# Altium schematic sheet SOC_DISPLAY.schdoc: =
size A3; Symbol: Sheet-Symbol_A4; Company: 嘉立创EDA; Version: V1.0; Page Size: A4; @Project Name: RK3568_LPD4X_120P_Core; @Page Count: 18; @Update Date: 2025-08-25; @Create Date: 2025-08-15; @Schematic Name: Schematic1; @Page No: 10; @Page Name: SOC_DISPLAY; Device: Sheet-Symbol_A4; Border: 1; Title Block Position: 3; Width: 1655; Height: 1170; Region Start: 1; X Region Count: 6; Y Region Count: 4; Blade Width: 10; @Board Name: Board1; @Create Time: 15:00:32; @Update Time: 13:23:47; Organization: ORGANIZATION; Address1: ADDRESS 1; Address2: ADDRESS 2; Address3: ADDRESS 3; Address4: ADDRESS 4; SheetNumber: 12; SheetTotal: 28
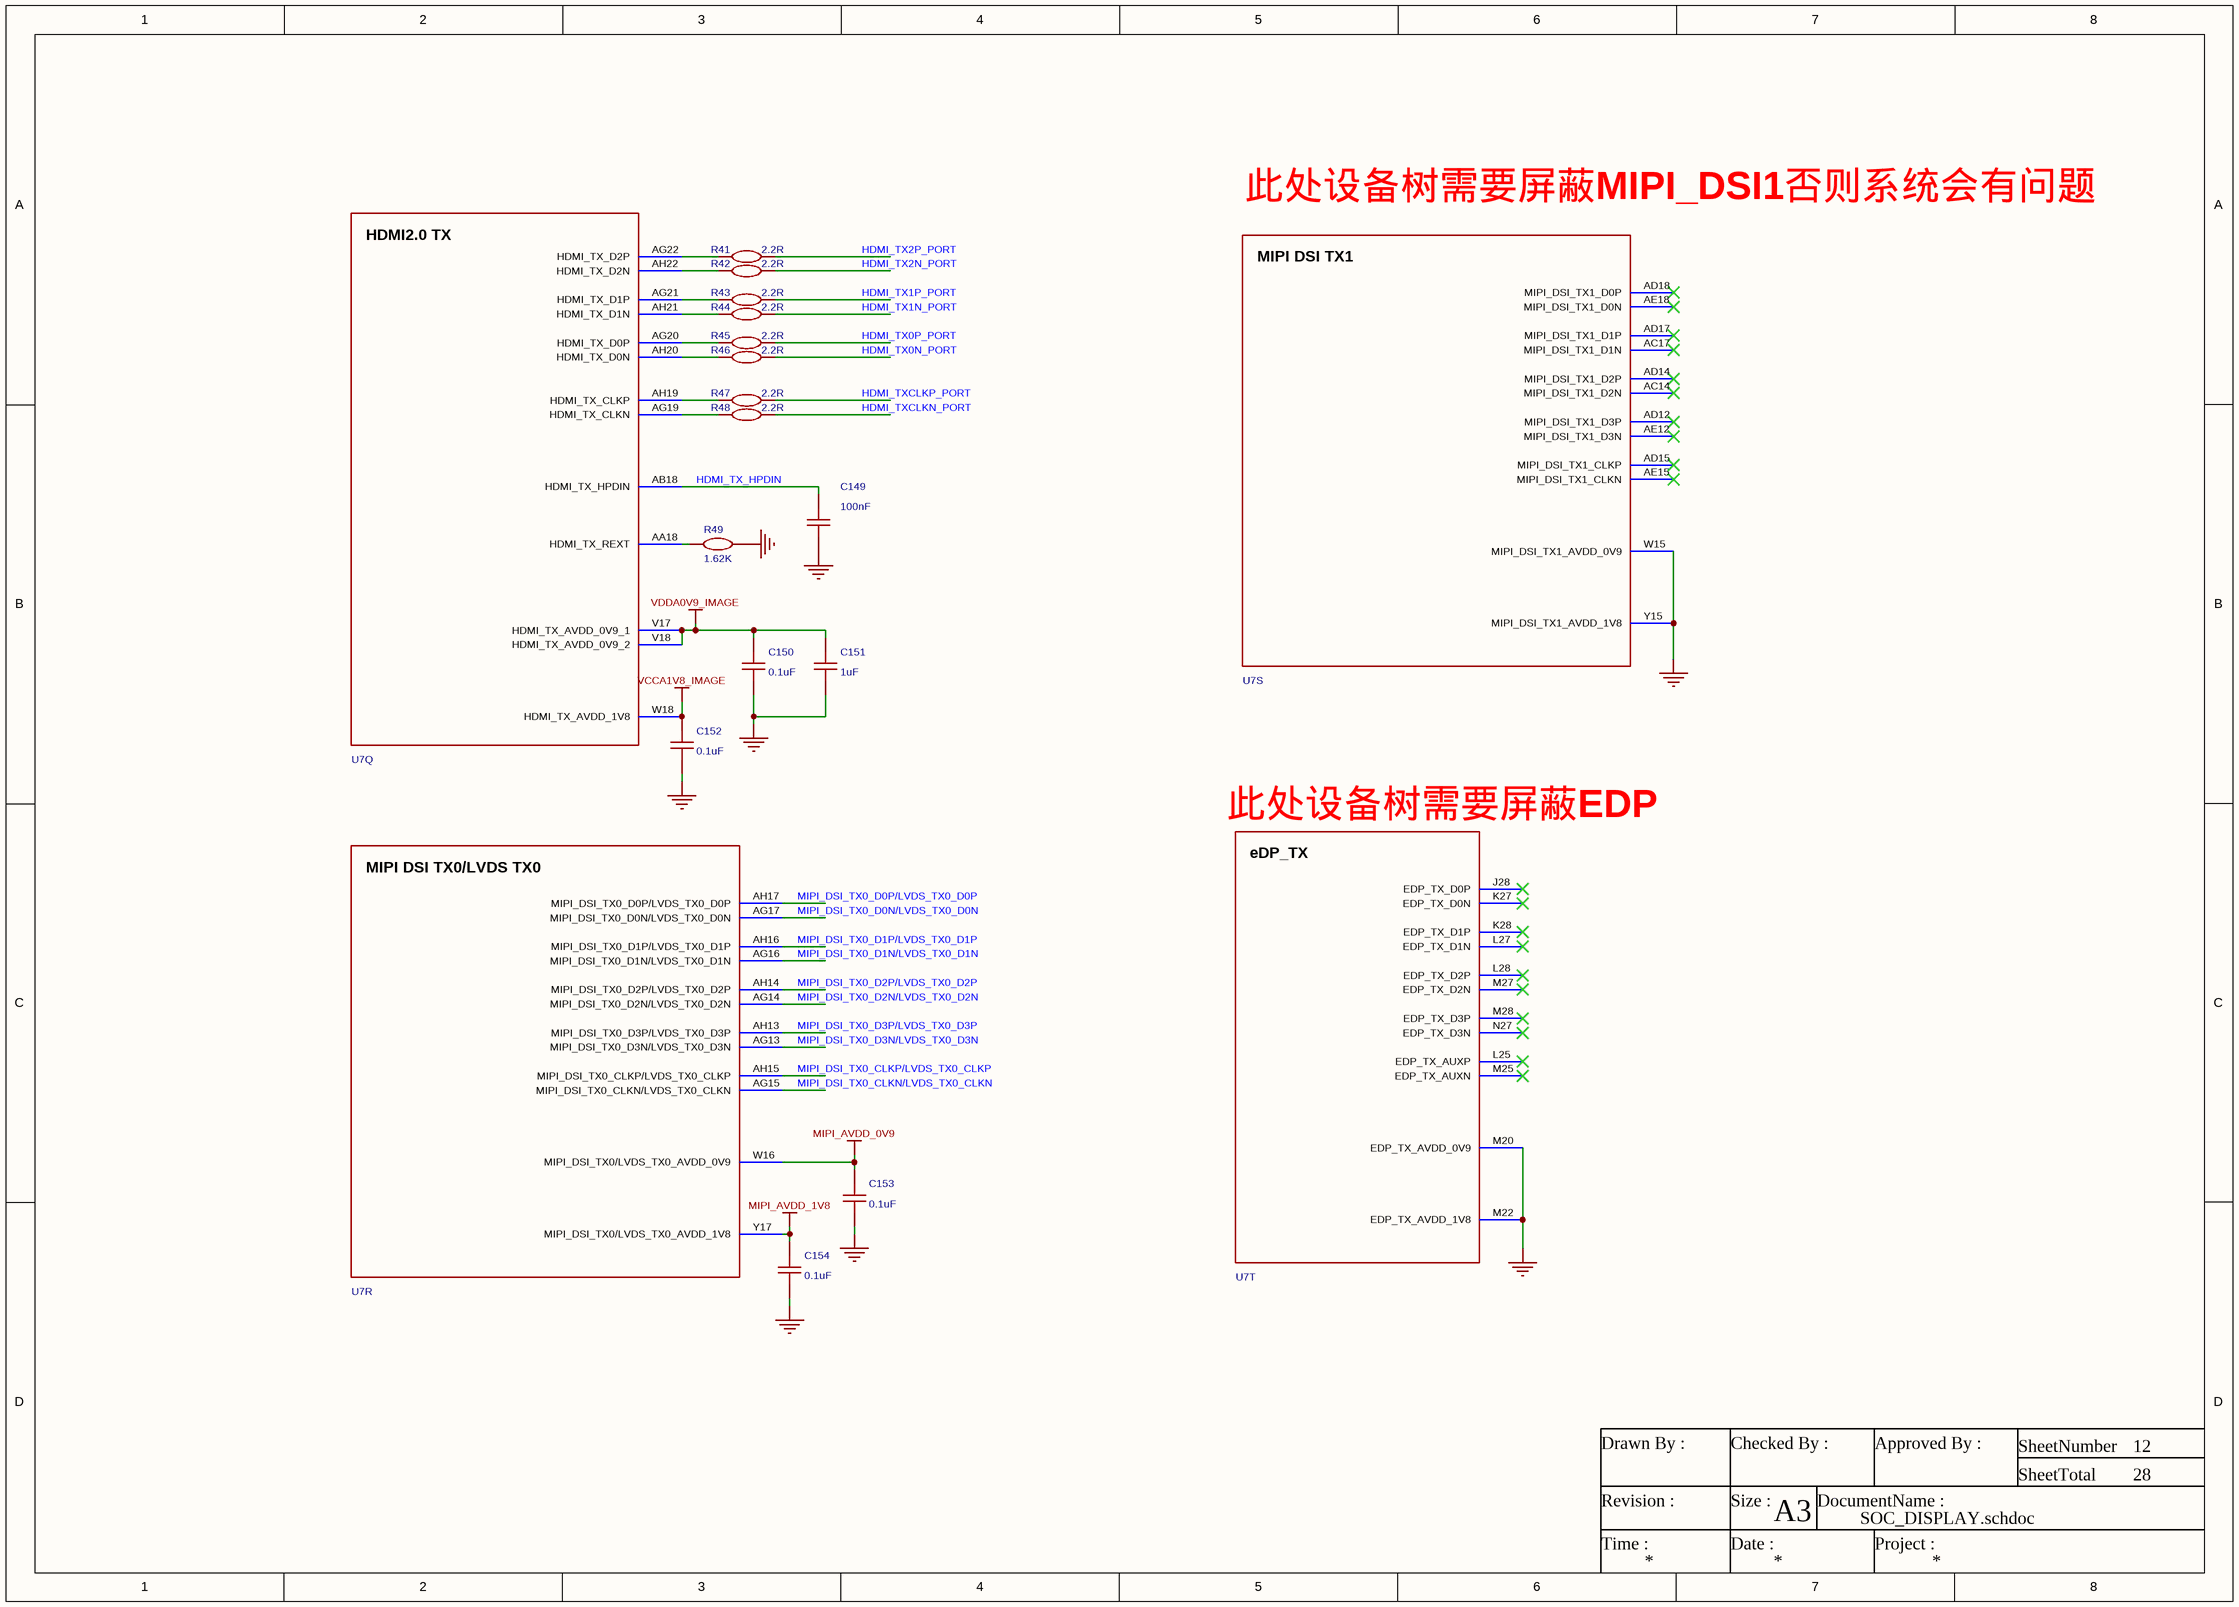
[diagram p0: SOC_DISPLAY.schdoc]

## Parts
C149  100nF  [C0201]
C150  0.1uF  [C0201]
C151  1uF  [C0201]
C152  0.1uF  [C0201]
C153  0.1uF  [C0201]
C154  0.1uF  [C0201]
R41  2.2R  [R0201]
R42  2.2R  [R0201]
R43  2.2R  [R0201]
R44  2.2R  [R0201]
R45  2.2R  [R0201]
R46  2.2R  [R0201]
R47  2.2R  [R0201]
R48  2.2R  [R0201]
R49  1.62K  [R0201]
U7  RK3568  [BGA-636_L19.0-W19.0-P0.65-BL]  (value not drawn)  (parts Q,R,S,T of 23)

## Nets
GND: C149.1 C150.1 C151.1 C152.1 C153.1 C154.1 R49.2 U7.M20(EDP_TX_AVDD_0V9) U7.M22(EDP_TX_AVDD_1V8) U7.W15(MIPI_DSI_TX1_AVDD_0V9) U7.Y15(MIPI_DSI_TX1_AVDD_1V8)
MIPI_AVDD_0V9: C153.2 U7.W16(MIPI_DSI_TX0/LVDS_TX0_AVDD_0V9)
MIPI_AVDD_1V8: C154.2 U7.Y17(MIPI_DSI_TX0/LVDS_TX0_AVDD_1V8)
VCCA1V8_IMAGE: C152.2 U7.W18(HDMI_TX_AVDD_1V8)
VDDA0V9_IMAGE: C150.2 C151.2 U7.V17(HDMI_TX_AVDD_0V9_1) U7.V18(HDMI_TX_AVDD_0V9_2)
HDMI_TX0N_PORT: R46.2
HDMI_TX0P_PORT: R45.2
HDMI_TX1N_PORT: R44.2
HDMI_TX1P_PORT: R43.2
HDMI_TX2N_PORT: R42.2
HDMI_TX2P_PORT: R41.2
HDMI_TX_HPDIN: C149.2 U7.AB18(HDMI_TX_HPDIN)
HDMI_TXCLKN_PORT: R48.2
HDMI_TXCLKP_PORT: R47.2
MIPI_DSI_TX0_CLKN/LVDS_TX0_CLKN: U7.AG15(MIPI_DSI_TX0_CLKN/LVDS_TX0_CLKN)
MIPI_DSI_TX0_CLKP/LVDS_TX0_CLKP: U7.AH15(MIPI_DSI_TX0_CLKP/LVDS_TX0_CLKP)
MIPI_DSI_TX0_D0N/LVDS_TX0_D0N: U7.AG17(MIPI_DSI_TX0_D0N/LVDS_TX0_D0N)
MIPI_DSI_TX0_D0P/LVDS_TX0_D0P: U7.AH17(MIPI_DSI_TX0_D0P/LVDS_TX0_D0P)
MIPI_DSI_TX0_D1N/LVDS_TX0_D1N: U7.AG16(MIPI_DSI_TX0_D1N/LVDS_TX0_D1N)
MIPI_DSI_TX0_D1P/LVDS_TX0_D1P: U7.AH16(MIPI_DSI_TX0_D1P/LVDS_TX0_D1P)
MIPI_DSI_TX0_D2N/LVDS_TX0_D2N: U7.AG14(MIPI_DSI_TX0_D2N/LVDS_TX0_D2N)
MIPI_DSI_TX0_D2P/LVDS_TX0_D2P: U7.AH14(MIPI_DSI_TX0_D2P/LVDS_TX0_D2P)
MIPI_DSI_TX0_D3N/LVDS_TX0_D3N: U7.AG13(MIPI_DSI_TX0_D3N/LVDS_TX0_D3N)
MIPI_DSI_TX0_D3P/LVDS_TX0_D3P: U7.AH13(MIPI_DSI_TX0_D3P/LVDS_TX0_D3P)
NetR41_1: R41.1 U7.AG22(HDMI_TX_D2P)
NetR42_1: R42.1 U7.AH22(HDMI_TX_D2N)
NetR43_1: R43.1 U7.AG21(HDMI_TX_D1P)
NetR44_1: R44.1 U7.AH21(HDMI_TX_D1N)
NetR45_1: R45.1 U7.AG20(HDMI_TX_D0P)
NetR46_1: R46.1 U7.AH20(HDMI_TX_D0N)
NetR47_1: R47.1 U7.AH19(HDMI_TX_CLKP)
NetR48_1: R48.1 U7.AG19(HDMI_TX_CLKN)
NetR49_1: R49.1 U7.AA18(HDMI_TX_REXT)

Not connected (* = marked no-connect by the designer): U7 AC14(MIPI_DSI_TX1_D2N)* AC17(MIPI_DSI_TX1_D1N)* AD12(MIPI_DSI_TX1_D3P)* AD14(MIPI_DSI_TX1_D2P)* AD15(MIPI_DSI_TX1_CLKP)* AD17(MIPI_DSI_TX1_D1P)* AD18(MIPI_DSI_TX1_D0P)* AE12(MIPI_DSI_TX1_D3N)* AE15(MIPI_DSI_TX1_CLKN)* AE18(MIPI_DSI_TX1_D0N)* J28(EDP_TX_D0P)* K27(EDP_TX_D0N)* K28(EDP_TX_D1P)* L25(EDP_TX_AUXP)* L27(EDP_TX_D1N)* L28(EDP_TX_D2P)* M25(EDP_TX_AUXN)* M27(EDP_TX_D2N)* M28(EDP_TX_D3P)* N27(EDP_TX_D3N)*

## Notes on the sheet
- 此处设备树需要屏蔽MIPI_DSI1否则系统会有问题
- 此处设备树需要屏蔽EDP
- Drawn By :
- Checked By :
- Approved By :
- SheetNumber
- SheetTotal
- Revision :
- Time :
- Size :
- Date :
- A3
- DocumentName :
- Project :
- (in symbol RK3568, part Q) HDMI2.0 TX
- (in symbol RK3568, part R) MIPI DSI TX0/LVDS TX0
- (in symbol RK3568, part S) MIPI DSI TX1
- (in symbol RK3568, part T) eDP_TX

## Library data of the parts
C149-C154 = GRM035R60J475ME15D: 容值:4.7uF;精度:±20%;额定电压:6.3V;温度系数:X5R;; Manufacturer: muRata(村田); AddInBom: yes; ModelId: e8033a7cb35143ffb28e3b81b2577ea0; ModelName: C0201_L0.6-W0.3-H0.3; ModelTransform: 23.622,11.811,0,0,0,0,0,0,0; Tolerance: ±20%; Voltage Rating: 6.3V; Temperature Coefficient: X5R; Symbol: GRM035R60J475ME15D; Device: GRM035R60J475ME15D; LCSC Part Name: 4.7uF ±20% 6.3V; ManufacturerPart: GRM035R60J475ME15D; Supplier Footprint: 0201; JLCPCB Part Class: Extended Part; Datasheet: https://item.szlcsc.com/datasheet/GRM035R60J475ME15D/313624.html; Supplier: LCSC; ConvertToPcb: yes; FootprintName: C0201
  C149: Value: 100nF
  C150 C152-C154: Value: 0.1uF
  C151: Value: 1uF
R41-R48 = Res_0201: Symbol: 电阻; 3D Model: 0e006ba4c37b4b73b0e85d5d1c6800cb; 3D Model Transform: 23.622,11.811,0,0,0,0,0,-0.0005,0; ConvertToPcb: yes; ModelName: R0201_L0.6-W0.3-H0.3; Device: Res_0201; Supplier Footprint: 0201; Value: 2.2R; AddInBom: yes; FootprintName: R0201
R49 = Res_0201: ConvertToPcb: yes; SymbolName: 电阻; ModelId: 0e006ba4c37b4b73b0e85d5d1c6800cb; ModelName: R0201_L0.6-W0.3-H0.3; ModelTransform: 23.622,11.811,0,0,0,0,0,-0.0005,0; Value: 1.62K; Device: Res_0201; AddInBom: yes; Supplier Footprint: 0201; FootprintName: R0201
U7 = RK3568: ConvertToPcb: yes; ModelId: e6756cba1b9f43448429fdcd1d44d9d9; ModelTransform: 748.03,748.03,54.33,0,0,0,0,0,0; Symbol: RK3568; Device: RK3568; AddInBom: yes; FootprintName: BGA-636_L19.0-W19.0-P0.65-BL; ModelName: BGA-636_L19.0-W19.0-P0.65-BL